# Altium schematic sheet Startracker_Stepper.SchDoc
size A3; SheetNumber: 3; SheetTotal: 3
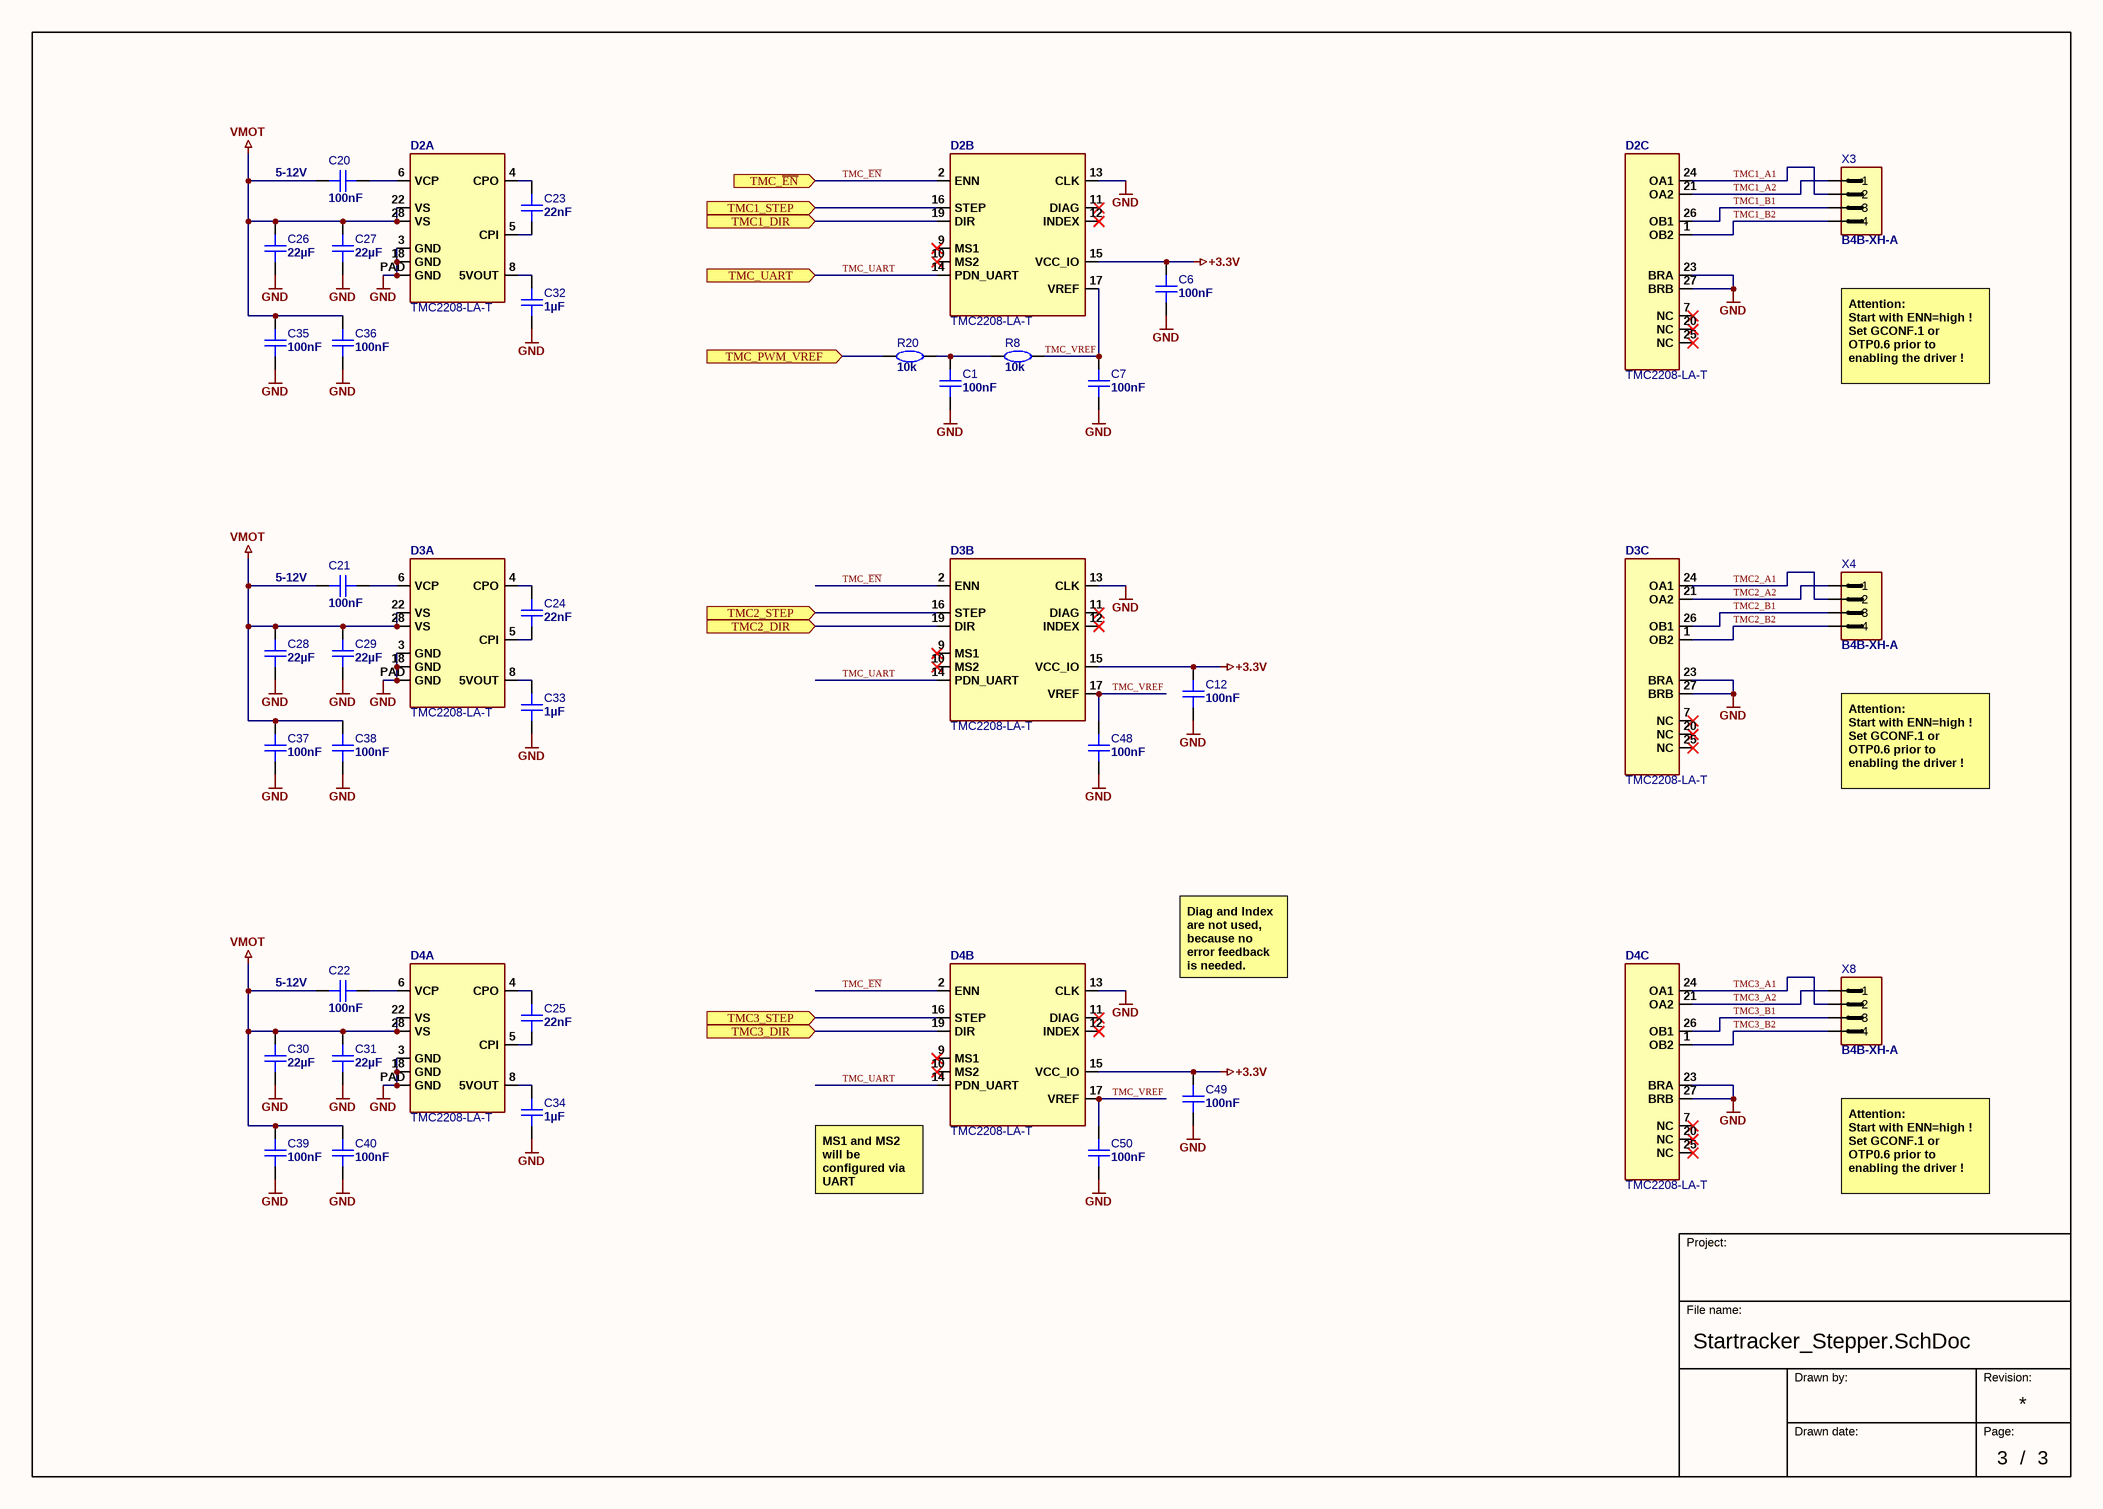
[diagram p0: Startracker_Stepper.SchDoc]

## Parts
C1  value 100nF  [C-0603_1608_095_L_RF]  (hidden comment: Cap 100n 0603)
C6  value 100nF  [C-0603_1608_095_L_RF]  (hidden comment: Cap 100n 0603)
C7  value 100nF  [C-0603_1608_095_L_RF]  (hidden comment: Cap 100n 0603)
C12  value 100nF  [C-0603_1608_095_L_RF]  (hidden comment: Cap 100n 0603)
C20  value 100nF  [C-0603_1608_095_L_RF]  (hidden comment: Cap 100n 0603)
C21  value 100nF  [C-0603_1608_095_L_RF]  (hidden comment: Cap 100n 0603)
C22  value 100nF  [C-0603_1608_095_L_RF]  (hidden comment: Cap 100n 0603)
C23  value 22nF  [C-0603_1608_095_L_RF]  (hidden comment: Cap 22n 0603)
C24  value 22nF  [C-0603_1608_095_L_RF]  (hidden comment: Cap 22n 0603)
C25  value 22nF  [C-0603_1608_095_L_RF]  (hidden comment: Cap 22n 0603)
C26  value 22µF  [C-1206_3216_230_L_RF]  (hidden comment: Cap 22u 25V 10% 1206)
C27  value 22µF  [C-1206_3216_230_L_RF]  (hidden comment: Cap 22u 25V 10% 1206)
C28  value 22µF  [C-1206_3216_230_L_RF]  (hidden comment: Cap 22u 25V 10% 1206)
C29  value 22µF  [C-1206_3216_230_L_RF]  (hidden comment: Cap 22u 25V 10% 1206)
C30  value 22µF  [C-1206_3216_230_L_RF]  (hidden comment: Cap 22u 25V 10% 1206)
C31  value 22µF  [C-1206_3216_230_L_RF]  (hidden comment: Cap 22u 25V 10% 1206)
C32  value 1µF  [C-0603_1608_095_L_RF]  (hidden comment: Cap 1u 0603)
C33  value 1µF  [C-0603_1608_095_L_RF]  (hidden comment: Cap 1u 0603)
C34  value 1µF  [C-0603_1608_095_L_RF]  (hidden comment: Cap 1u 0603)
C35  value 100nF  [C-0603_1608_095_L_RF]  (hidden comment: Cap 100n 0603)
C36  value 100nF  [C-0603_1608_095_L_RF]  (hidden comment: Cap 100n 0603)
C37  value 100nF  [C-0603_1608_095_L_RF]  (hidden comment: Cap 100n 0603)
C38  value 100nF  [C-0603_1608_095_L_RF]  (hidden comment: Cap 100n 0603)
C39  value 100nF  [C-0603_1608_095_L_RF]  (hidden comment: Cap 100n 0603)
C40  value 100nF  [C-0603_1608_095_L_RF]  (hidden comment: Cap 100n 0603)
C48  value 100nF  [C-0603_1608_095_L_RF]  (hidden comment: Cap 100n 0603)
C49  value 100nF  [C-0603_1608_095_L_RF]  (hidden comment: Cap 100n 0603)
C50  value 100nF  [C-0603_1608_095_L_RF]  (hidden comment: Cap 100n 0603)
D2  TMC2208-LA-T  [QFN28_N_RF]  (parts A,B,C of 3)
D3  TMC2208-LA-T  [QFN28_N_RF]  (parts A,B,C of 3)
D4  TMC2208-LA-T  [QFN28_N_RF]  (parts A,B,C of 3)
R8  value 10k  [R-0603_1608_050_L_RF]  (hidden comment: Res 10k 0603)
R20  value 10k  [R-0603_1608_050_L_RF]  (hidden comment: Res 10k 0603)
X3  value B4B-XH-A  [X-0124X0057-R_M04_P0250_JST_B4B-XH-A]  (hidden comment: CONN HEADER XH 4POS THT)
X4  value B4B-XH-A  [X-0124X0057-R_M04_P0250_JST_B4B-XH-A]  (hidden comment: CONN HEADER XH 4POS THT)
X8  value B4B-XH-A  [X-0124X0057-R_M04_P0250_JST_B4B-XH-A]  (hidden comment: CONN HEADER XH 4POS THT)

## Ports
TMC1_DIR (in), TMC1_STEP (in), TMC2_DIR (in), TMC2_STEP (in), TMC3_DIR (in), TMC3_STEP (in), TMC_PWM_VREF (in), TMC_UART (in), TMC_~{EN} (in)

## Nets
+3.3V: C6.1 C12.1 C49.1 D2.15(VCC_IO) D3.15(VCC_IO) D4.15(VCC_IO)
GND: C1.2 C6.2 C7.2 C12.2 C26.1 C27.1 C28.1 C29.1 C30.1 C31.1 C32.1 C33.1 C34.1 C35.1 C36.1 C37.1 C38.1 C39.1 C40.1 C48.2 C49.2 C50.2 D2.3(GND) D2.13(CLK) D2.18(GND) D2.23(BRA) D2.27(BRB) D2.PAD(GND) D3.3(GND) D3.13(CLK) D3.18(GND) D3.23(BRA) D3.27(BRB) D3.PAD(GND) D4.3(GND) D4.13(CLK) D4.18(GND) D4.23(BRA) D4.27(BRB) D4.PAD(GND)
VMOT: C20.2 C21.2 C22.2 C26.2 C27.2 C28.2 C29.2 C30.2 C31.2 C35.2 C36.2 C37.2 C38.2 C39.2 C40.2 D2.22(VS) D2.28(VS) D3.22(VS) D3.28(VS) D4.22(VS) D4.28(VS)
TMC1_A1: D2.24(OA1) X3.2
TMC1_A2: D2.21(OA2) X3.1
TMC1_B1: D2.26(OB1) X3.3
TMC1_B2: D2.1(OB2) X3.4
TMC1_DIR: D2.19(DIR) ; port TMC1_DIR
TMC1_STEP: D2.16(STEP) ; port TMC1_STEP
TMC2_A1: D3.24(OA1) X4.2
TMC2_A2: D3.21(OA2) X4.1
TMC2_B1: D3.26(OB1) X4.3
TMC2_B2: D3.1(OB2) X4.4
TMC2_DIR: D3.19(DIR) ; port TMC2_DIR
TMC2_STEP: D3.16(STEP) ; port TMC2_STEP
TMC3_A1: D4.24(OA1) X8.2
TMC3_A2: D4.21(OA2) X8.1
TMC3_B1: D4.26(OB1) X8.3
TMC3_B2: D4.1(OB2) X8.4
TMC3_DIR: D4.19(DIR) ; port TMC3_DIR
TMC3_STEP: D4.16(STEP) ; port TMC3_STEP
TMC_~{EN}: D2.2(ENN) D3.2(ENN) D4.2(ENN) ; port TMC_~{EN}
TMC_PWM_VREF: R20.1 ; port TMC_PWM_VREF
TMC_UART: D2.14(PDN_UART) D3.14(PDN_UART) D4.14(PDN_UART) ; port TMC_UART
TMC_VREF: C7.1 C48.1 C50.1 D2.17(VREF) D3.17(VREF) D4.17(VREF) R8.2
NetC1_1: C1.1 R8.1 R20.2
NetC20_1: C20.1 D2.6(VCP)
NetC21_1: C21.1 D3.6(VCP)
NetC22_1: C22.1 D4.6(VCP)
NetC23_1: C23.1 D2.5(CPI)
NetC23_2: C23.2 D2.4(CPO)
NetC24_1: C24.1 D3.5(CPI)
NetC24_2: C24.2 D3.4(CPO)
NetC25_1: C25.1 D4.5(CPI)
NetC25_2: C25.2 D4.4(CPO)
NetC32_2: C32.2 D2.8(5VOUT)
NetC33_2: C33.2 D3.8(5VOUT)
NetC34_2: C34.2 D4.8(5VOUT)

Not connected (* = marked no-connect by the designer): D2 7(NC)* 9(MS1)* 10(MS2)* 11(DIAG)* 12(INDEX)* 20(NC)* 25(NC)*; D3 7(NC)* 9(MS1)* 10(MS2)* 11(DIAG)* 12(INDEX)* 20(NC)* 25(NC)*; D4 7(NC)* 9(MS1)* 10(MS2)* 11(DIAG)* 12(INDEX)* 20(NC)* 25(NC)*

## Notes on the sheet
- (near C20) 5-12V
- Attention:
  Start with ENN=high !
  Set GCONF.1 or OTP0.6 prior to enabling the driver !
- (near C21) 5-12V
- (near C22) 5-12V
- Diag and Index are not used, because no error feedback is needed.
- (near D4) MS1 and MS2 will be configured via UART
- Project:
- File name:
- Drawn by:
- Revision:
- Drawn date:
- Page:
- /

## Library data of the parts
C1 C6 C7 C12 C20-C22 C35-C40 C48-C50 = CMP-001-0037-3: Cap Cer SMD 100n 50V 10% 0603 X7R; Manufacturer: KEMET; Manufacturer Part Number: C0603C104K5RAC; User: epph; Prefered: true; MNL_Number: 22310507; GPV_Number: 1749.0075; Case / Package: 0603; PartStatus: Release; Technology: SMT; ClassName: Surface_Assy
C23-C25 = CMP-001-0047-2: Cap Cer SMD 22n 50V 10% 0603 X7R; Manufacturer Part Number: 06035C223KAT*; Manufacturer: AVX; GPV_Number: 1749.0099; Prefered: true; User: zupa; PartStatus: Release; ComponentLink1Description: Datasheet; ComponentLink1URL: https://datasheet.ciiva.com/11464/ccog-11464569.pdf; ClassName: Surface_Assy; Technology: SMT; Case / Package: 0603
C26-C31 = CMP-001-0137-2: Cap Cer SMD 22u 25V 10% 1206 X5R; Manufacturer Part Number: GRM31CR61E226KE15*; Manufacturer: MURATA; Prefered: false; GPV_Number: 1751.0116; User: zupa; PartStatus: Release; Technology: SMT; ComponentLink1Description: Datasheet; ComponentLink1URL: https://datasheet.ciiva.com/3778/100grm31cr61e226ke1523-3778430.pdf; ClassName: Surface_Assy; Case / Package: 1206
C32-C34 = CMP-001-0045-2: Cap Cer SMD 1u 16V 10% 0603 X7R; Manufacturer Part Number: 0603YC105KAT*; Manufacturer: AVX; Prefered: true; User: zupa; GPV_Number: 1749.0125; MNL_Number: 22310613; ComponentLink1Description: Datasheet; ClassName: Surface_Assy; PartStatus: Release; Case / Package: 0603; ComponentLink1URL: https://datasheet.ciiva.com/11464/ccog-11464569.pdf; Technology: SMT
D2-D4 = TMC2208-LA-T: IC DRIVER Stepper 1.4A; Part_validated: No; Manufacturer: Analog Devices; GPV_Number: xxxx.xxxx; MNL_Number: xxxxxxxx; Value: TMC2208-LA-T; Footprint_validated: No; PartStatus: New; System: -; ClassName: Surface_Assy; Case/Package: QFN28; Technology: SMT; Manufacturer Part Number: TMC2208-LA-T
R8 R20 = CMP-001-0241-3: Res SMD 10k 1% 0.1W 0603; Manufacturer: YAGEO; Manufacturer Part Number: RC0603FR-0710KL; MNL_Number: 15310022; GPV_Number: 1922.0100; User: zupa; Prefered: true; Case / Package: 0603; ClassName: Surface_Assy; PartStatus: Release; ComponentLink1URL: https://datasheet.ciiva.com/11808/0900766b80f96399-11808280.pdf; ComponentLink1Description: Datasheet; Technology: SMT
X3 X4 X8 = CMP-00142-3: CONN HEADER  4POS_JST_B4B-XH; Manufacturer: JST; System: Connector; User: balu; GPV_Number: 4401.1048; ClassName: Through-Hole_Assy; Technology: THT; Manufacturer Part Number: B4B-XH-A; PartStatus: Release